# EAGLE design Parking Sensor USB -v18 (EAGLE 7.1.0)
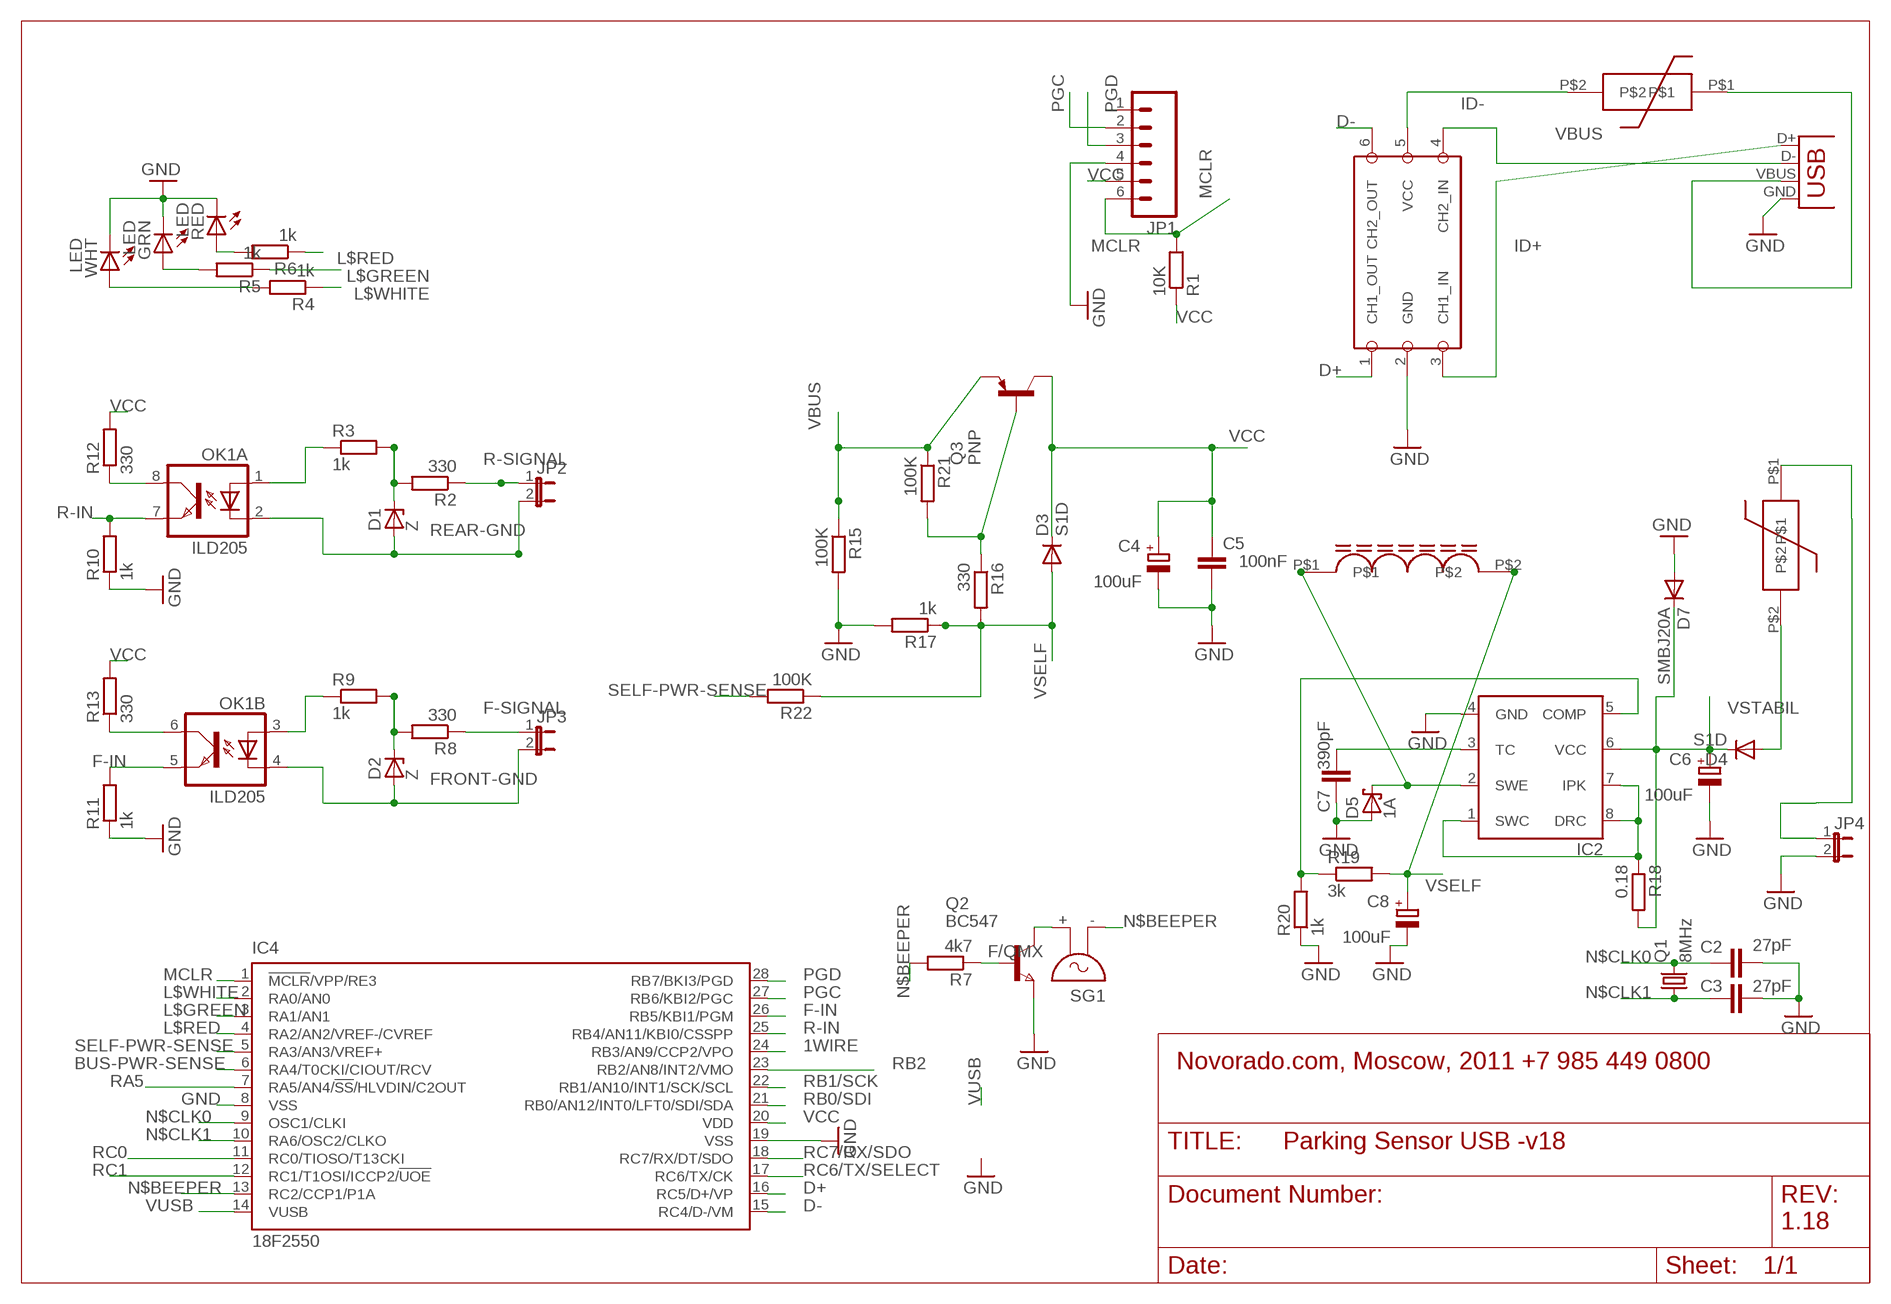
[diagram p0: schematic, sheet 1]

## Parts
C2  27pF  C-EUC1206  [C1206]
C3  27pF  C-EUC1206  [C1206]
C4  100uF  CPOL-EU153CLV-0505  [153CLV-0505]
C5  100nF  C-EUC0603  [C0603]
C6  100uF  CPOL-EU153CLV-0505  [153CLV-0505]
C7  390pF  C-EUC0805  [C0805]
C8  100uF  CPOL-EU153CLV-0505  [153CLV-0505]
D1  Z  ZENER-DIODESOT23  [SOT23]
D2  Z  ZENER-DIODESOT23  [SOT23]
D3  S1D  DIODE-DO214AC  [DO214AC]
D4  S1D  DIODE-DO-214AC  [DO-214AC]
D5  1A  MBRS130LT3  [SMB]
D7  SMBJ20A  DIODE-DO214AA  [DO214AA]
GRN  LED  LEDCHIPLED_0805  [CHIPLED_0805]
IC2  MC34063AD  [SO08]
IC4  18F2550  PIC18F2550_28W  [SO28W]
JP1  M06SMD  [1X06-SMD]
JP2  JP1E  [JP1]
JP3  JP1E  [JP1]
JP4  JP1E  [JP1]
OK1  ILD205  [SOIC08]
Q1  8MHz  CRYSTALHC49UP  [HC49UP]
Q2  BC547  NPNSOT23  [SOT-23]
Q3  PNP  BC807-40SMD  [SOT23-BEC]
R1  10K  R-EU_M1206  [M1206]
R2  330  R-EU_M1206  [M1206]
R3  1k  R-EU_M1206  [M1206]
R4  1k  R-EU_M1206  [M1206]
R5  1k  R-EU_M1206  [M1206]
R6  1k  R-EU_M1206  [M1206]
R7  4k7  R-EU_M1206  [M1206]
R8  330  R-EU_M1206  [M1206]
R9  1k  R-EU_M1206  [M1206]
R10  1k  R-EU_M1206  [M1206]
R11  1k  R-EU_M1206  [M1206]
R12  330  R-EU_M1206  [M1206]
R13  330  R-EU_M1206  [M1206]
R15  100K  R-EU_M1206  [M1206]
R16  330  R-EU_M1206  [M1206]
R17  1k  R-EU_M1206  [M1206]
R18  0.18  R-EU_0204/7  [0204/7]
R19  3k  R-EU_M1206  [M1206]
R20  1k  R-EU_M1206  [M1206]
R21  100K  R-EU_M1206  [M1206]
R22  100K  R-EU_M1206  [M1206]
RED  LED  LEDCHIPLED_0805  [CHIPLED_0805]
SG1  F/QMX  [F/QMX]
U$1  EMI  TPD2S017DBVR  [SOT23-DBV]
U$2  MF-SM050  [SMD2029]
U$3  MF-SM050  [SMD2029]
U$5  SDR0302  [SDR0302]
WHT  LED  LEDCHIP-LED0805  [CHIP-LED0805]
X2  USBSMD  [USB-MINIB]

## Nets
1WIRE: IC4.24(RB3/AN9/CCP2/VPO)
BUS-PWR-SENSE: IC4.6(RA4/T0CKI/CIOUT/RCV)
D+: IC4.16(RC5/D+/VP) U$1.1(CH1_OUT)
D-: IC4.15(RC4/D-/VM) U$1.6(CH2_OUT)
F-IN: IC4.26(RB5/KBI1/PGM) OK1.5(B:EMIT) R11.2
F-SIGNAL: JP3.1 R8.1
FRONT-GND: D2.1(A) JP3.2 OK1.4(B:C)
FUSE_USB: U$2.P$1 X2.VBUS
GND: C2.2 C3.2 C4.- C5.2 C6.- C7.1 C8.- D5.A D7.A GRN.C IC2.4(GND) IC4.8(VSS) IC4.19(VSS) JP1.4 JP4.2 Q2.2(E) R10.1 R11.1 R15.2 R17.2 R20.1 RED.C U$1.2(GND) WHT.C X2.GND
ID+: U$1.3(CH1_IN) X2.D+
ID-: U$1.4(CH2_IN) X2.D-
L$16: GRN.A R5.2
L$18: R6.2 RED.A
L$20: R4.2 WHT.A
L$GREEN: IC4.3(RA1/AN1) R5.1
L$RED: IC4.4(RA2/AN2/VREF-/CVREF) R6.1
L$WHITE: IC4.2(RA0/AN0) R4.1
MCLR: IC4.1(!MCLR!/VPP/RE3) JP1.6 R1.2
N$13: Q2.3(B) R7.1
N$24: Q2.1(C) SG1.+
N$29: Q3.B R16.1 R21.2
N$BEEPER: IC4.13(RC2/CCP1/P1A) R7.2 SG1.-
N$CLK0: C2.1 IC4.9(OSC1/CLKI) Q1.2
N$CLK1: C3.1 IC4.10(RA6/OSC2/CLKO) Q1.1
O1$1: OK1.1(A:A) R3.1
O1$2: OK1.3(B:A) R9.1
O1$3: D2.3(C) R8.2 R9.2
O1$4: OK1.6(B:COL) R13.1
O1$7: D1.3(C) R2.2 R3.2
O1$26: OK1.8(A:COL) R12.1
PGC: IC4.27(RB6/KBI2/PGC) JP1.2
PGD: IC4.28(RB7/BKI3/PGD) JP1.3
R-IN: IC4.25(RB4/AN11/KBI0/CSSPP) OK1.7(A:EMIT) R10.2
R-SIGNAL: JP2.1 R2.1
RA5: IC4.7(RA5/AN4/!SS!/HLVDIN/C2OUT)
RB0/SDI: IC4.21(RB0/AN12/INT0/LFT0/SDI/SDA)
RB1/SCK: IC4.22(RB1/AN10/INT1/SCK/SCL)
RB2: IC4.23(RB2/AN8/INT2/VMO)
RC0: IC4.11(RC0/TIOSO/T13CKI)
RC1: IC4.12(RC1/T1OSI/ICCP2/!UOE)
RC6/TX/SELECT: IC4.17(RC6/TX/CK)
RC7/RX/SDO: IC4.18(RC7/RX/DT/SDO)
REAR-GND: D1.1(A) JP2.2 OK1.2(A:C)
SELF-PWR-SENSE: IC4.5(RA3/AN3/VREF+) R22.2
V5$3: JP4.1 U$3.P$1
V5$4: D4.A U$3.P$2
V5$8: IC2.1(SWC) IC2.7(IPK) IC2.8(DRC) R18.1
V5$15: C7.2 IC2.3(TC)
V5$17: D5.C IC2.2(SWE) U$5.P$1
V5$47: IC2.5(COMP) R19.1 R20.2
VBUS: Q3.E R15.1 R21.1 U$1.5(VCC) U$2.P$2
VCC: C4.+ C5.1 D3.C IC4.20(VDD) JP1.5 Q3.C R1.1 R12.2 R13.2
VSELF: C8.+ D3.A R16.2 R17.1 R19.2 R22.1 U$5.P$2
VSTABIL: C6.+ D4.C D7.C IC2.6(VCC) R18.2
VUSB: IC4.14(VUSB)
Unconnected: JP1.1

## Notes on the sheet
- Novorado.com, Moscow, 2011 +7 985 449 0800
- 1.18

## Library data of the parts
C2 C3 C5 C7 = rcl:C-EU: CAPACITOR, European symbol
C4 C6 C8 = rcl:CPOL-EU: POLARIZED CAPACITOR, European symbol
D1 D2 = diode:ZENER-DIODE: Z-Diode
D3 D4 D7 = diode:DIODE-: DIODE
D5 = diode:MBRS130LT3: Schottky Power Rectifier Source: http://www.onsemi.com/pub/Collateral/MBRS130LT3-D.PDF
GRN RED WHT = led:LED: LED OSRAM: - CHIPLED LG R971, LG N971, LY N971, LG Q971, LY Q971, LO R971, LY R971 LH N974, LH R974 LS Q976, LO Q976, LY Q976 LO Q996 - Hyper CHIPLED LW Q18S LB Q993, LB Q99A, LB R99A - SideLED LS A670, LO A670, LY A670, LG A670, LP A670 LB A673, LV A673, LT A673, LW A673 LH A674 LY A675 LS A676, LA A676, LO A676, LY A676, LW A676 LS A679, LY A679, LG A679 - Hyper Micro SIDELED® LS Y876, LA Y876, LO Y876, LY Y876 LT Y87S - SmartLED LW L88C, LW L88S LB L89C, LB L89S, LG L890 LS L89K, LO L89K, LY L89K LS L896, LA L896, LO L896, LY L896 - TOPLED LS T670, LO T670, LY T670, LG T670, LP T670 LSG T670, LSP T670, LSY T670, LOP T670, LYG T670 LG T671, LOG T671, LSG T671 LB T673, LV T673, LT T673, LW T673 LH T674 LS T676, LA T676, LO T676, LY T676, LB T676, LH T676, LSB T676, LW T676 LB T67C, LV T67C, LT T67C, LS T67K, LO T67K, LY T67K, LW E67C LS E67B, LA E67B, LO E67B, LY E67B, LB E67C, LV E67C, LT E67C LW T67C LS T679, LY T679, LG T679 LS T770, LO T770, LY T770, LG T770, LP T770 LB T773, LV T773, LT T773, LW T773 LH T774 LS E675, LA E675, LY E675, LS T675 LS T776, LA T776, LO T776, LY T776, LB T776 LHGB T686 LT T68C, LB T68C - Hyper Mini TOPLED® LB M676 - Mini TOPLED Santana® LG M470 LS M47K, LO M47K, LY M47K Source: http://www.osram.convergy.de LUXEON: - LUMILED® LXK2-PW12-R00, LXK2-PW12-S00, LXK2-PW14-U00, LXK2-PW14-V00 LXK2-PM12-R00, LXK2-PM12-S00, LXK2-PM14-U00 LXK2-PE12-Q00, LXK2-PE12-R00, LXK2-PE12-S00, LXK2-PE14-T00, LXK2-PE14-U00 LXK2-PB12-K00, LXK2-PB12-L00, LXK2-PB12-M00, LXK2-PB14-N00, LXK2-PB14-P00, LXK2-PB14-Q00 LXK2-PR12-L00, LXK2-PR12-M00, LXK2-PR14-Q00, LXK2-PR14-R00 LXK2-PD12-Q00, LXK2-PD12-R00, LXK2-PD12-S00 LXK2-PH12-R00, LXK2-PH12-S00 LXK2-PL12-P00, LXK2-PL12-Q00, LXK2-PL12-R00 Source: www.luxeon.com KINGBRIGHT: KA-3528ASYC Source: www.kingbright.com
IC2 = v-reg-3:MC34063A: 1.5A Step-Up/Down/Inverting Switching Regulator NPN Darlington Switch, Vin 3V to 40V, Current Limiter Input, adjustable Frequency up to 100kHz
IC4 = microchip:PIC18F2*_28: USB Microcontrollers with nanoWatt Technology High-Performance, Enhanced Flash, 28/40/44-Pin, Source: http://ww1.microchip.com/downloads/en/devicedoc/39632c.pdf; MF: MICROCHIP; MPN: PIC18F2550-I/SO; OC_FARNELL: 9321268; OC_NEWARK: 73K1297
JP1 = SparkFun:M06: Header 6 Standard 6-pin 0.1" header. Use with straight break away headers (SKU : PRT-00116), right angle break away headers (PRT-00553), swiss pins (PRT-00743), machine pins (PRT-00117), and female headers (PRT-00115). Molex polarized connector foot print use with SKU : PRT-08094 with associated crimp pins and housings. NOTES ON THE VARIANTS LOCK and LOCK_LONGPADS... This footprint was designed to help hold the alignment of a through-hole component (i.e. 6-pin header) while soldering it into place. You may notice that each hole has been shifted either up or down by 0.005 of an inch from it's more standard position (which is a perfectly straight line). This slight alteration caused the pins (the squares in the middle) to touch the edges of the holes. Because they are alternating, it causes a "brace" to hold the component in place. 0.005 has proven to be the perfect amount of "off-center" position when using our standard breakaway headers. Although looks a little odd when you look at the bare footprint, once you have a header in there, the alteration is very hard to notice. Also, if you push a header all the way into place, it is covered up entirely on the bottom side. This idea of altering the position of holes to aid alignment will be further integrated into the Sparkfun Library for other footprints. It can help hold any component with 3 or more connection pins.
JP2-JP4 = jumper:JP1E: JUMPER
OK1 = optocoupler:ILD2*: Siemens ILD205/206/207/211/213/217 DUAL PHOTOTRANSISTOR SMALL OUTLINE SURFACE MOUNT OPTOCOUPLER Source: 153385-da-01-en-Optocoupler_ILD205-T.pdf; MF: VISHAY/TELEFUNKEN; MPN: ILD205T; OC_FARNELL: 1469512; OC_NEWARK: 20H8678
Q1 = crystal:CRYSTAL: CRYSTAL; OC_FARNELL: unknown; OC_NEWARK: unknown
Q2 = zetex:NPNSOT23: NPN TRANSISTOR; MPN: DSS20201L-7; OC_FARNELL: 1710688; OC_NEWARK: 25R4555
Q3 = transistor-pnp:BC807*: PNP Transistror
R1 R7 R15-R18 R21 R22 = rcl:R-EU_: RESISTOR, European symbol
R2-R6 R8-R13 R19 R20 = resistor:R-EU_: RESISTOR, European symbol
SG1 = buzzer:F/QMX: BUZZER Source: Buerklin; OC_FARNELL: unknown; OC_NEWARK: unknown
U$1 = novorado:TPD2S017DBVR: 2-CHANNEL ULTRA-LOW CLAMP VOLTAGE ESD SOLUTION WITH SERIES-RESISTOR ISOLATION
U$2 U$3 = novorado:MF-SM050: MF-SM Series - PTC Resettable Fuses
U$5 = novorado:SDR0302
X2 = SparkFun:USB: USB Connectors USB-B-PTH is fully proven SKU : PRT-00139 USB-miniB is fully proven SKU : PRT-00587 USB-A-PCB is untested. USB-A-H is throughly reviewed, but untested. Spark Fun Electronics SKU : PRT-00437 USB-B-SMT is throughly reviewed, but untested. Needs silkscreen touching up. USB-A-S has not been used/tested USB-MB-H has not been used/tested

## Net classes
1 ESD: width 0.7 mm

## Board
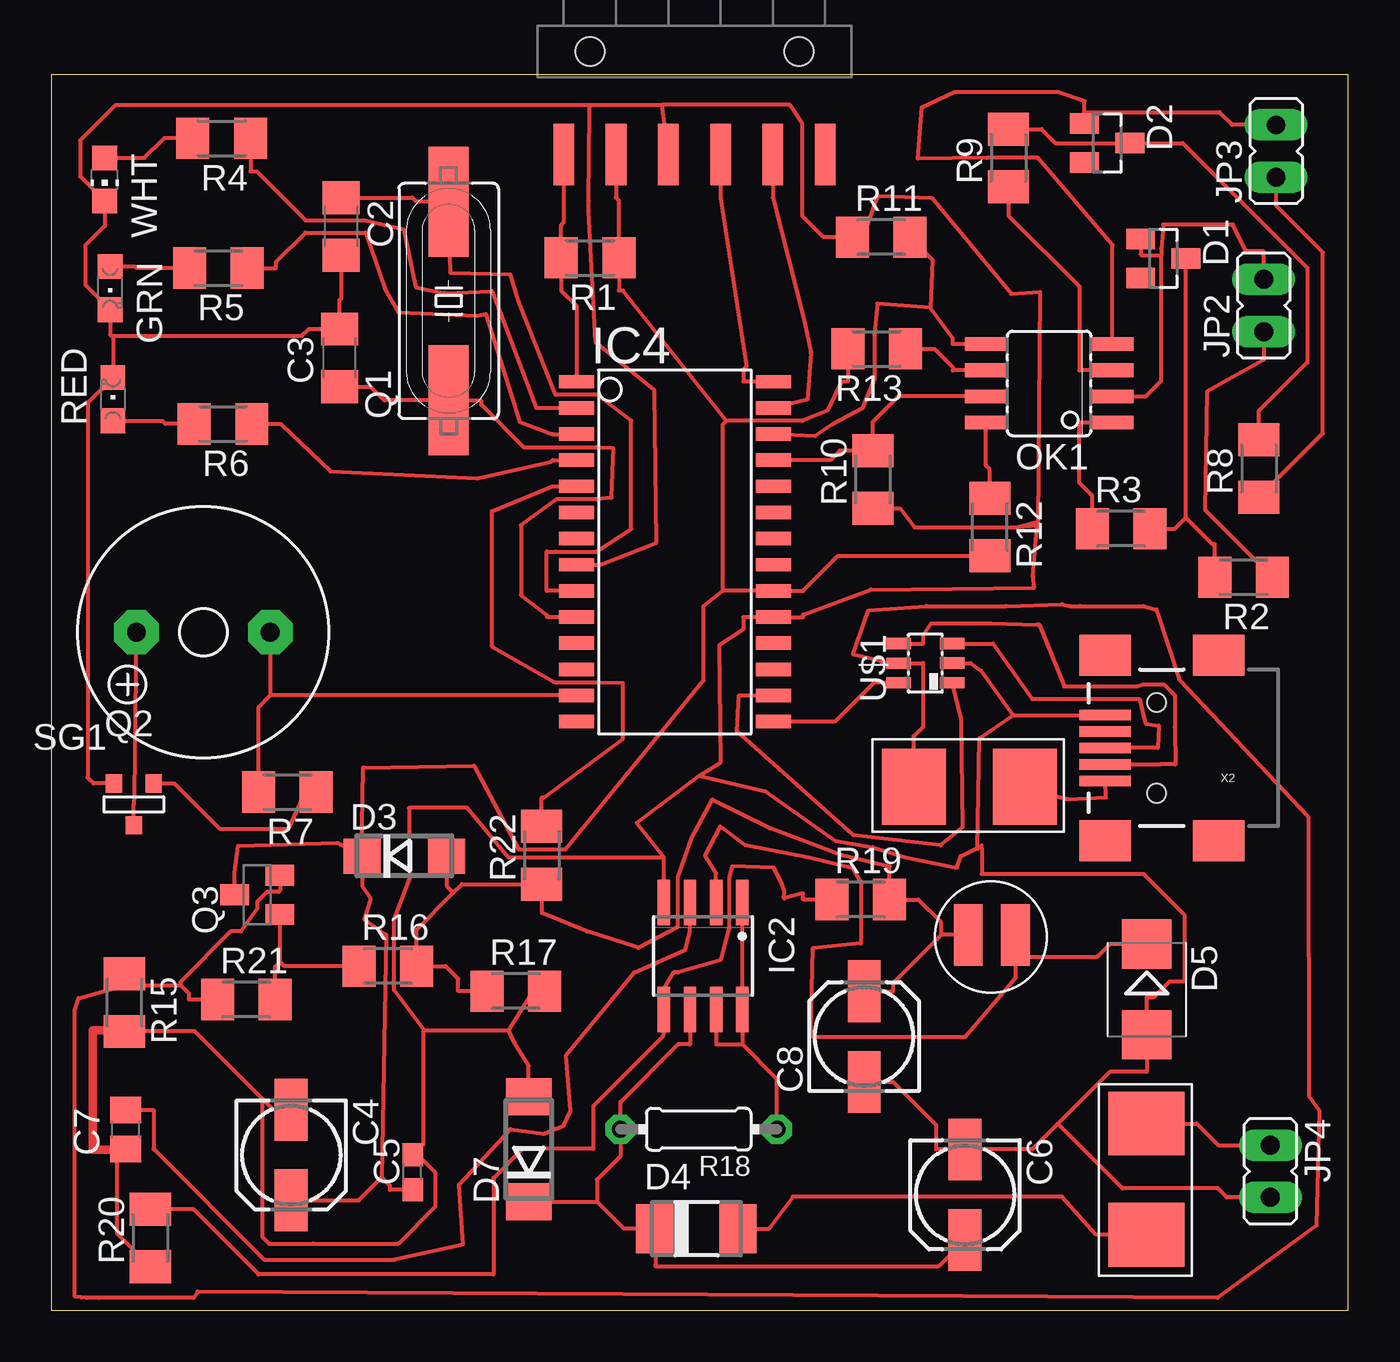
[diagram p1: board, top side]

Size 63 x 60 mm. Coordinates in mm from the lower left corner, seen from the top.
Outline: 0,0 63,0 63,60 0,60 0,0
Copper layers (1*16): Top 0.035mm / dielectric 1.5mm / Bottom 0.035mm
Design rules "default": minimum track width 8mil, minimum drill 20mil, track to track 0.5mm, track to pad 0.5mm, pad to pad 8mil, via to via 8mil, smd to smd 8mil, copper to edge 10mil, drill to drill 8mil, minimum pad ring 12mil, minimum via ring 10mil, stop-mask expansion 4mil, vias tented up to drill 25mil, thermal gap 10mil
bRestrict: area 0,0 to 63,60

### Footprints (pad centres in the part's own frame; a part is rotated, then mirrored left to right if it is on the bottom)
C1206 = smd 1.6 x 1.8: 1 -1.4,0; 2 1.4,0
153CLV-0505 = smd 3 x 1.6: + 2.2,0; - -2.2,0
C0603 = smd 1.1 x 1: 1 -0.85,0; 2 0.85,0
C0805 = smd 1.3 x 1.5: 1 -0.95,0; 2 0.95,0
SOT23 = smd 1 x 1.4: 1 -0.95,-1.1; 2 0.95,-1.1; 3 0,1.1
DO214AC = smd 1.8 x 1.7: A 2.05,0; C -2.05,0
DO-214AC = smd 1.8 x 2.4: A 2.025,0; C -2.025,0
SMB = smd 2.4 x 2.4: A 2.2,0; C -2.2,0
DO214AA = smd 1.8 x 2.2: A 2.55,0; C -2.55,0
CHIPLED_0805 = smd 1.2 x 1.2: A 0,-1.05; C 0,1.05
SO08 = smd 0.6 x 2.2: 1 -1.905,-2.6; 2 -0.635,-2.6; 3 0.635,-2.6; 4 1.905,-2.6; 5 1.905,2.6; 6 0.635,2.6; 7 -0.635,2.6; 8 -1.905,2.6
SO28W = smd 0.65 x 1.7: 1 -7.62,-4.78; 2 -6.35,-4.78; 3 -5.08,-4.78; 4 -3.81,-4.78; 5 -2.54,-4.78; 6 -1.27,-4.78; 7 0,-4.78; 8 1.27,-4.78; 9 2.54,-4.78; 10 3.81,-4.78; 11 5.08,-4.78; 12 6.35,-4.78; 13 7.62,-4.78; 14 8.89,-4.78; 15 8.89,4.78; 16 7.62,4.78; 17 6.35,4.78; 18 5.08,4.78; 19 3.81,4.78; 20 2.54,4.78; 21 1.27,4.78; 22 0,4.78; 23 -1.27,4.78; 24 -2.54,4.78; 25 -3.81,4.78; 26 -5.08,4.78; 27 -6.35,4.78; 28 -7.62,4.78
1X06-SMD = smd 1 x 3: 1 -6.35,5; 2 -3.81,5; 3 -1.27,5; 4 1.27,5; 5 3.81,5; 6 6.35,5 | hole 1.4: -5.08,0; 5.08,0
JP1 = drill 0.914 long: 1 0,-1.27; 2 0,1.27
SOIC08 = smd 0.66 x 2.032: 1 -1.905,-3.073; 2 -0.635,-3.073; 3 0.635,-3.073; 4 1.905,-3.073; 5 1.905,3.073; 6 0.635,3.073; 7 -0.635,3.073; 8 -1.905,3.073
HC49UP = smd 5.334 x 1.93: 1 -4.826,0; 2 4.826,0
SOT-23 = smd 0.787 x 0.889: 1 0.025,-1.016; 2 -0.94,1.016; 3 0.991,1.016
SOT23-BEC = smd 1 x 1.4: B -0.95,-1.1; C 0,1.1; E 0.95,-1.1
M1206 = smd 1.6 x 2: 1 -1.4,0; 2 1.4,0
0204/7 = drill 0.813 octagon: 1 -3.81,0; 2 3.81,0
F/QMX = drill 0.914 pad 2.159 octagon: + 3.251,0; - -3.251,0
SOT23-DBV = smd 0.55 x 1.2: 1 -0.95,-1.3; 2 0,-1.3; 3 0.95,-1.3; 4 0.95,1.3; 5 -0.003,1.3; 6 -0.95,1.3
SMD2029 = smd 3.1 x 3.7: P$1 1.6,1.9; P$2 7,1.9
SDR0302 = smd 3 x 1.4: P$1 0,1.2; P$2 0,-1.1
CHIP-LED0805 = smd 1.2 x 1.2: A 0,-1.05; C 0,1.05
USB-MINIB = smd 2.5 x 0.5: D+ 2.5,0; D- 2.5,0.8; GND 2.5,-1.6; ID 2.5,-0.8; VBUS 2.5,1.6 | smd 2.5 x 2: MTN1 -3,4.5; MTN2 2.5,4.5; MTN3 -3,-4.5; MTN4 2.5,-4.5 | hole 0.9: 0,2.2; 0,-2.2

### Placement (x,y rotation side)
C2  14.07,52.64 270 top
C3  14,46.26 90 top
C4  11.65,7.54 270 top
C5  17.55,6.7 90 top
C6  44.39,5.61 270 top
C7  3.61,8.78 90 top
C8  39.49,13.29 90 top
D1  54.02,51.09 270 top
D2  51.29,56.69 270 top
D3  17.15,22.05 0 top
D4  31.34,3.96 0 top
D5  53.22,15.58 270 top
D7  23.19,7.82 90 top
GRN  2.85,49.65 180 top
IC2  31.66,17.21 180 top
IC4  30.29,37.48 270 top
JP1  31.24,61.14 180 top
JP2  58.9,48.8 0 top
JP3  59.5,56.3 0 top
JP4  59.23,6.75 180 top
OK1  48.48,45.02 90 top
Q1  19.3,49.02 90 top
Q2  3.98,24.57 0 top
Q3  10,20.18 90 top
R1  26.17,51.12 180 top
R2  57.92,35.61 180 top
R3  51.97,37.96 0 top
R4  8.27,56.92 180 top
R5  8.11,50.62 180 top
R6  8.34,43.05 180 top
R7  11.47,25.17 180 top
R8  58.67,40.88 90 top
R9  46.5,55.97 90 top
R10  39.91,40.35 90 top
R11  40.31,52.12 0 top
R12  45.59,38.04 270 top
R13  40.09,46.7 180 top
R15  3.55,14.94 270 top
R16  16.34,16.71 0 top
R17  22.56,15.5 0 top
R18  31.45,8.79 180 top
R19  39.32,19.95 0 top
R20  4.81,3.51 90 top
R21  9.47,15.09 0 top
R22  23.82,22.1 90 top
RED  2.99,44.25 0 top
SG1  7.38,32.93 180 top
U$1  42.46,31.43 90 top
U$2  48.9,27.33 180 top
U$3  51.3,10.67 270 top
U$5  45.64,18.23 270 top
WHT  2.59,54.92 180 top
X2  53.7,27.31 180 top

### Tracks (layer width: path | path; a pad name or v marks a point on that pad's centre or on a via)
D+
  Top 0.203: U$1.1 44.2,28.7 44.26,23.44 43.2,22.57 38.96,23.07 33.31,28.12 33.41,29.86 IC4.16
D-
  Top 0.203: U$1.6 39.96,30.48 38.07,28.59 IC4.15
F-IN
  Top 0.203: OK1.5 43.79,46.92 43.79,47.22 42.72,48.7 | R11.2 42.81,51.02 42.72,48.7 | 42.72,48.7 40.13,48.9 39.98,47.45 39.98,45.24 39.4,43.8 37.95,43.03 37.1,42.46 IC4.26
F-SIGNAL
  Top 0.203: JP3.1 59.5,53.67 61.78,51.38 61.78,42.59 R8.1
FRONT-GND
  Top 0.203: JP3.2 57.37,57.57 56.75,58.19 50.19,58.19 | 50.19,58.19 50.19,58.74 48.9,59.18 43.91,59.18 42.29,58.42 42.09,55.94 45.43,55.98 47.93,55.98 51.55,51.75 OK1.4 | D2.1 50.19,58.19
FUSE_USB
  Top 0.203: U$2.P$1 49.35,24.83 51.23,24.91 X2.VBUS
GND
  Top 0.203: 48.9,9.06 47.65,7.81 C6.- 42.99,7.81 42.99,8.99 40.89,11.09 C8.- | 48.9,9.06 51.42,11.58 53.22,11.58 D5.A 53.22,15.18 53.52,15.18 53.6,15.24 54.32,15.96 55.04,15.96 55.04,19.22 53.06,21.2 45.2,21.2 45.2,22.44 45.13,22.52 | 48.9,9.06 52.04,5.92 56.67,5.92 57.1,5.48 JP4.2 | 46.96,38.02 47.94,38.1 48.04,49.46 46.64,49.36 42.77,54.02 40.17,54.12 39.46,52.12 R11.1 37.51,52.12 36.49,53.14 36.49,57.63 35.87,58.54 29.67,58.54 | 26.14,58.24 26.14,58.54 29.67,58.54 | 26.14,58.24 26.16,58.52 3.09,58.52 1.39,56.82 1.39,55.07 WHT.C 2.59,52.67 1.65,51.73 1.65,49.8 GRN.C 2.85,47.4 2.92,47.33 2.99,47.33 | IC4.8 26.66,36.21 29.4,37.28 29.3,44.68 26.44,47.02 26.1,53.4 26.1,53.9 26.14,58.24 | JP1.4 29.67,58.54 | D7.A 23.19,11.87 22.5,12.96 22.2,13.6 | 2.99,47.33 12.17,47.33 12.5,47.66 C3.2 14,49.06 14.07,49.13 C2.2 | 2.99,47.33 RED.C 1.76,44.07 1.76,25.87 2.04,25.59 Q2.2 | IC2.4 29.75,21.99 | R10.1 41.22,38.95 41.94,38.02 46.96,38.02 | 46.96,38.02 47.9,38.28 47.7,35.65 47.75,35.1 39.8,35 36.52,33.79 36.52,33.67 IC4.19 33.62,33.67 33.62,33.08 32.44,32.29 32.5,26.6 31.5,25.96 | U$1.2 44.66,31.43 45.16,31.06 46.72,28.91 | 46.72,28.91 X2.GND | 45.13,22.52 45.2,22.57 44.19,22.06 44,21.5 41.5,22 39.9,22.5 38.1,22.8 34.7,25.2 31.5,25.96 | 45.13,22.52 45,22.4 45.1,27.79 46.72,28.91 | R17.2 23.41,15.5 22.2,13.6 | 31.5,25.96 28.43,23.66 29.75,21.99 | 29.75,21.99 22.21,21.99 20.2,24.41 17.37,24.41 17.4,21 16.64,18.97 16.64,15.56 18.1,13.6 | 18.1,13.6 22.2,13.6 | R20.1 3.2,3.72 3.2,7.42 C7.1 3.22,7.5 3.3,7.7 | 18.1,13.6 18.06,13.5 18.06,8.06 C5.2 17.74,7.6 18.66,6.68 18.66,5.04 16.86,3.24 12.72,3.24 12.7,3.22 10.58,3.22 10.58,3.24 10.24,3.58 10.24,10.12 10.31,10.19
  Top 0.203: 10.31,10.19 10.76,9.74 C4.- | 10.31,10.19 6.96,13.54 R15.2
  Top 0.406: R15.2 3.55,13.6 2.2,13.6 2,13.6 2,7.8 3.3,7.8 3.3,7.7
ID+
  Top 0.203: U$1.3 45.76,32.38 47.64,29.69 52.86,29.69 53.16,28.49 53.8,28.4 53.76,27.31 X2.D+
ID-
  Top 0.203: X2.D- 53.85,26.51 54.55,26.53 54.6,26.5 54.57,28.33 54.57,29.87 54.04,30.4 53.05,30.4 52.74,30.3 49.21,30.3 48,33.3 47.9,33.3 45.65,33.36 42.74,33.36 42.36,32.78 42.36,32.38 U$1.4
L$16
  Top 0.203: GRN.A 4.05,50.7 4.13,50.62 R5.2
L$18
  Top 0.203: R6.2 5.54,43.05 5.39,43.2 RED.A
L$20
  Top 0.203: R4.2 5.47,56.92 4.52,55.97 WHT.A
L$GREEN
  Top 0.203: R5.1 10.91,50.62 10.91,50.92 12.34,52.34 15.26,52.34 16.2,49.6 16.86,48.47 20.7,48.3 21.1,48.4 22.75,43.15 24.36,42.56 IC4.3
L$RED
  Top 0.203: R6.1 11.14,43.05 13.55,40.74 20.7,40.4 24.29,41.22 24.36,41.29 IC4.4
L$WHITE
  Top 0.203: R4.1 9.67,55.32 9.97,55.32 12.35,52.94 15.25,52.94 17.1,52.5 17.7,49.7 19.1,49.4 21.4,49.5 23.55,43.83 IC4.2
MCLR
  Top 0.203: JP1.6 24.89,52.84 24.77,52.72 R1.2 24.77,49.52 25.51,48.78 IC4.1
N$13
  Top 0.203: Q2.3 5.97,25.59 8.19,23.36 11.51,23.36 12.32,25.17 R7.1
N$24
  Top 0.203: Q2.1 4,24.6 4.03,25.02 SG1.+
N$29
  Top 0.203: 11.1,16.92 Q3.B | 11.1,16.92 10.87,16.69 R21.2 | R16.1 11.31,16.71 11.1,16.92
N$BEEPER
  Top 0.203: R7.2 10.07,29.3 10.63,29.86 | IC4.13 10.63,29.86 | SG1.- 10.63,29.86
N$CLK0
  Top 0.203: IC4.9 24.06,34.94 24.06,36.85 24.5,36.84 26.48,36.84 28.17,37.94 28.17,43.22 26.52,44.47 24.5,44.47 22.7,49 22.3,50.3 19.4,50.37 Q1.2 17.73,53.85 17.54,54.04 C2.1
N$CLK1
  Top 0.203: IC4.10 24.06,33.67 24.06,33.78 22.81,34.73 22.81,38.14 24.53,39.39 26.49,39.39 27.2,39.46 27.27,41.88 26.51,41.92 22.94,41.92 20.87,44 20.87,44.19 Q1.1 16.17,44.19 15.5,44.86 C3.1
O1$1
  Top 0.203: R3.1 50.57,39.56 49.94,40.2 49.94,43.12 OK1.1
O1$2
  Top 0.203: OK1.3 49.94,45.66 49.94,49.73 46.5,53.17 R9.1
O1$3
  Top 0.203: R8.2 58.67,43.68 61.03,46.04 61.03,50.63 54.97,56.69 D2.3 48.78,56.69 48.1,57.37 R9.2
O1$4
  Top 0.203: OK1.6 43.79,45.66 43.79,45.8 42.89,46.7 R13.1
O1$7
  Top 0.203: 55.12,38.5 D1.3 | 55.12,38.5 54.58,37.96 R3.2 | 55.12,38.5 56.41,37.21 56.52,37.21 R2.2
O1$26
  Top 0.203: R12.1 45.59,40.84 45.41,41.02 OK1.8
PGC
  Top 0.203: JP1.2 35.05,54.04 36.59,48.01 36.9,46.5 36.73,44.23 IC4.27
PGD
  Top 0.203: IC4.28 33.62,45.1 33.62,45.7 33.76,45.84 32.51,54.04 JP1.3
R-IN
  Top 0.203: IC4.25 37.85,41.29 38.31,41.75 R10.2 39.91,43.15 41.14,44.38 OK1.7
R-SIGNAL
  Top 0.203: JP2.1 58.9,46.17 56.16,44.63 56.06,38.87 R2.1
REAR-GND
  Top 0.203: JP2.2 58.9,51.43 58.02,51.43 57.41,52.73 54.02,52.73 53.92,51.56 53.92,51.23 | OK1.2 53.17,44.38 53.92,45.14 53.92,51.23 | D1.1 52.92,51.29 52.98,51.23 53.92,51.23
SELF-PWR-SENSE
  Top 0.203: R22.2 23.82,24.9 23.91,24.9 27.77,27.76 27.77,30.46 26.53,30.49 24.49,30.49 21.42,32.23 21.41,38.81 24.36,40.02 IC4.5
V5$3
  Top 0.203: U$3.P$1 55.65,9.07 56.7,8.02 JP4.1
V5$4
  Top 0.203: D4.A 34.87,3.96 36.02,5.51 49.1,5.51 50.75,3.67 U$3.P$2
V5$8
  Top 0.203: R18.1 35.26,11.21 33.56,12.91 | 33.56,12.91 32.3,12.91 IC2.7 | 33.56,12.91 IC2.8 IC2.1
V5$15
  Top 0.203: C7.2 4.96,9.73 4.96,7.84 10.35,2.45 16.67,2.45 16.77,2.5 20,3.2 19.8,6.1 22.3,8.8 23.93,8.56 24.88,8.96 25.21,9.69 25.01,12.39 28.3,16.4 30.8,17.5 31.02,18.41 IC2.3
V5$17
  Top 0.203: D5.C 51.42,17.78 50.82,17.18 46.84,17.18 | 46.84,17.18 46.84,16.13 44.4,13.29 36.99,13.29 36.88,13.59 36.98,17.58 39.33,17.82 39.33,20.78 38.92,21.48 36.8,22 33.7,22.6 32.5,23.5 31.76,22.08 32.3,21.21 IC2.2 | U$5.P$1 46.84,17.18
V5$47
  Top 0.203: R19.1 36.52,19.95 36.52,20.25 35.6,20 35.61,20.36 35.5,20.7 35.1,21.5 33.08,21.55 32.93,21.01 32.93,18.59 32.5,17 30.46,16.41 30.23,16.41 29.75,15.64 IC2.5 29.75,13.42 29.72,13.32 26.32,9.92 26.32,7.84 22.9,7.84 21.48,6.42 21.48,1.74 10.06,1.74 6.9,4.9 R20.2
VBUS
  Top 0.203: U$2.P$2 41.9,27.88 42.36,28.34 42.36,31.43 U$1.5 40.37,31.43 40.26,31.54 38.95,31.84 39.71,33.99 42.5,34.2 46.39,34.19 49.1,34.3 49.5,34.2 49.98,34.2 53.08,34.2 53.7,34.03 54.8,30.62 61.07,23.96 61.1,10.4 61.6,9.7 61.47,4.11 56.66,0.6 7.1,0.9 6.9,0.6 2.28,0.6 1.7,0.6 1.46,0.63 1.14,0.66 1.14,14.58 1.32,15.16 3.55,15.79 | R21.1 6.67,15.09 6.67,15.39 6.27,15.79 | 3.55,15.79 6.27,15.79 | Q3.E 11.1,20.38 11.04,20.32 10.49,20.32 10.01,19.84 10.01,19.52 9.2,18.4 8.72,18.4 6.27,15.95 6.27,15.79 | R15.1 3.55,15.79
VCC
  Top 0.203: R12.2 38.22,36.64 36.52,34.94 IC4.20 32.62,34.94 | C5.1 16.45,5.85 16.45,6.06 16.05,6.46 | D3.C 15.1,23.5 15.15,26.35 20.53,26.45 22.69,22.39 24.99,22.39 31.69,30.6 31.69,34.22 32.62,34.94 | D3.C 15.1,20.6 15.5,20 15.2,19 16.25,18.25 16.05,6.46 | Q3.C 8.9,21.28 9.07,22.55 13.9,22.7 D3.C | R13.2 38.69,45.1 38.39,45.1 37.7,43.7 36.49,43.2 32.79,43.2 | JP1.5 27.43,54.04 27.57,53.9 R1.1 27.57,49.52 27.77,49.52 32.79,43.2 | C4.+ 14.94,5.34 16.05,6.46 | 32.79,43.2 32.62,43.02 32.62,34.94
VSELF
  Top 0.203: C8.+ 40.89,15.49 40.89,15.88 43.24,18.23 | U$5.P$2 43.24,18.23 | 43.24,18.23 43.24,18.83 42.12,19.95 R19.2 40.72,21.55 38.38,22.09 34.9,23.4 32.1,24.8 31.08,22.89 30.42,21.04 30.42,18.61 28.52,17.61 26.01,18.41 23.82,19.3 R22.1 19.95,20.7 19.52,20.27 | R17.1 19.76,15.5 19.76,16.09 19.14,16.71 R16.2 17.74,18.49 19.52,20.27 | 19.52,20.27 19.2,20.6 D3.A
VSTABIL
  Top 0.203: IC2.6 31.02,12.91 30.45,12.91 27.64,10.1 R18.2 27.64,7.48 26.5,6.34 26.5,5.27 | 26.5,5.27 27.81,3.96 D4.C 29.34,3.86 29.34,2.14 43.12,2.14 C6.+ | D7.C 26.5,5.27